# Altium schematic sheet Power Supply.SchDoc: Power Supplies
size A4; DocumentNumber: 4; Revision: D; SheetNumber: 4; SheetTotal: 7
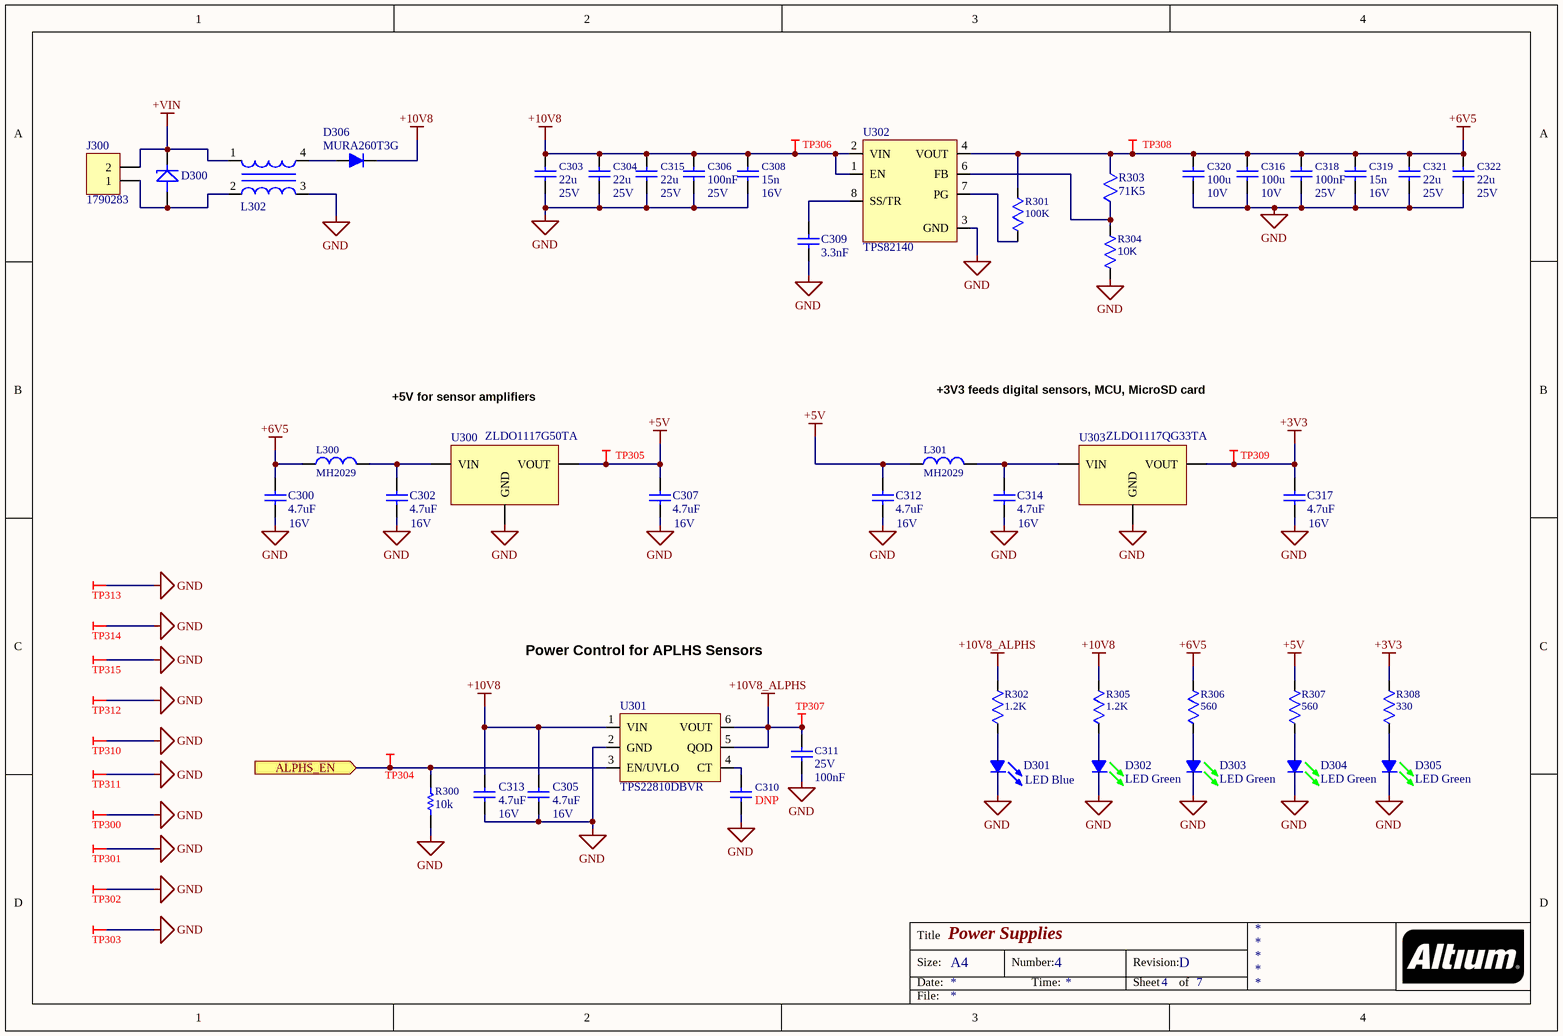
[diagram p0: Power Supply.SchDoc]

## Parts
C300  4.7uF  Voltage: 16V  [C1005[0402]]
C302  4.7uF  Voltage: 16V  [C1005[0402]]
C303  value 22u  Voltage: 25V  [CAPC2012X14N]
C304  value 22u  Voltage: 25V  [CAPC2012X14N]
C305  4.7uF  Voltage: 16V  [C1005[0402]]
C306  value 100nF  Voltage: 25V  [CAPC1005X06N]  (hidden comment: 4.7uF)
C307  4.7uF  Voltage: 16V  [C1005[0402]]
C308  value 15n  Voltage: 16V  [CAPC1005X06N]  (hidden comment: 4.7uF)
C309  3.3nF  [C1608[0603]]
C310  value DNP  [CAPC1005X06N]  (hidden comment: 4.7uF)
C311  value 100nF  Voltage: 25V  [CAPC1005X06N]  (hidden comment: 4.7uF)
C312  4.7uF  Voltage: 16V  [C1005[0402]]
C313  4.7uF  Voltage: 16V  [C1005[0402]]
C314  4.7uF  Voltage: 16V  [C1005[0402]]
C315  value 22u  Voltage: 25V  [CAPC2012X14N]
C316  value 100u  Voltage: 10V  [C3225[1210]_Tall]  (hidden comment: 4.7uF)
C317  4.7uF  Voltage: 16V  [C1005[0402]]
C318  value 100nF  Voltage: 25V  [CAPC1005X06N]  (hidden comment: 4.7uF)
C319  value 15n  Voltage: 16V  [CAPC1005X06N]  (hidden comment: 4.7uF)
C320  value 100u  Voltage: 10V  [C3225[1210]_Tall]  (hidden comment: 4.7uF)
C321  value 22u  Voltage: 25V  [CAPC2012X14N]
C322  value 22u  Voltage: 25V  [CAPC2012X14N]
D300  12V TVS  [NXP PTVSxS1UR-Series (SOD123W)]  (value not drawn)
D301  SMLE12BC7TT86  [LED_0603]  (value not drawn)
D302  LED Green  [LED_0603]
D303  LED Green  [LED_0603]
D304  LED Green  [LED_0603]
D305  LED Green  [LED_0603]
D306  MURA260T3G  [Diode SMA DIOM5226X240N]
J300  1790283  [5.08mm 2pos TermBlock]
L300  MH2029  [L2012[0805]]
L301  MH2029  [L2012[0805]]
L302  CM3421Y600R-10  [CM3421Y600R-10]  (value not drawn)
R300  value 10k  [RESC1005X03N]  (hidden comment: RES: GENERAL)
R301  100K  [RESC1005X03N]
R302  1.2K  [R1608[0603] small]
R303  71K5  [RESC1005X03N]
R304  10K  [RESC1005X03N]
R305  1.2K  [R1608[0603] small]
R306  560  [R1608[0603] small]
R307  560  [R1608[0603] small]
R308  330  [R1608[0603] small]
TP300  PAD  [TP_SMD_39MIL]  (value not drawn)  (no BOM)
TP301  PAD  [TP_SMD_39MIL]  (value not drawn)  (no BOM)
TP302  PAD  [TP_SMD_39MIL]  (value not drawn)  (no BOM)
TP303  PAD  [TP_SMD_39MIL]  (value not drawn)  (no BOM)
TP304  PAD  [TP_SMD_39MIL]  (value not drawn)  (no BOM)
TP305  PAD  [TP_SMD_39MIL]  (value not drawn)  (no BOM)
TP306  PAD  [TP_SMD_39MIL]  (value not drawn)  (no BOM)
TP307  PAD  [TP_SMD_39MIL]  (value not drawn)  (no BOM)
TP308  PAD  [TP_SMD_39MIL]  (value not drawn)  (no BOM)
TP309  PAD  [TP_SMD_39MIL]  (value not drawn)  (no BOM)
TP310  PAD  [TP_SMD_39MIL]  (value not drawn)  (no BOM)
TP311  PAD  [TP_SMD_39MIL]  (value not drawn)  (no BOM)
TP312  PAD  [TP_SMD_39MIL]  (value not drawn)  (no BOM)
TP313  PAD  [TP_SMD_39MIL]  (value not drawn)  (no BOM)
TP314  PAD  [TP_SMD_39MIL]  (value not drawn)  (no BOM)
TP315  PAD  [TP_SMD_39MIL]  (value not drawn)  (no BOM)
U300  ZLDO1117G50TA  [SOT230P700X165-4N]
U301  TPS22810DBVR  [SOT23]
U302  TPS82140  [SIL0008D]
U303  ZLDO1117QG33TA  [SOT230P700X165-4N]

## Ports
ALPHS_EN (in)

## Nets
+3V3: C317.2 R308.2 TP309.1 U303.2(VOUT)
+5V: C307.2 C312.2 L301.1 R307.2 TP305.1 U300.2(VOUT)
+6V5: C300.2 C316.1 C318.1 C319.1 C320.1 C321.1 C322.1 L300.1 R301.2 R303.2 R306.2 TP308.1 U302.4(VOUT)
+10V8: C303.1 C304.1 C305.2 C306.1 C308.1 C313.2 C315.1 D306.1(K) R305.2 TP306.1 U301.1(VIN) U302.1(EN) U302.2(VIN)
+10V8_ALPHS: C311.1 R302.2 TP307.1 U301.5(QOD) U301.6(VOUT)
+VIN: D300.1 J300.2 L302.1
GND: C300.1 C302.1 C303.2 C304.2 C305.1 C306.2 C307.1 C308.2 C309.1 C310.2 C311.2 C312.1 C313.1 C314.1 C315.2 C316.2 C317.1 C318.2 C319.2 C320.2 C321.2 C322.2 D301.2 D302.2 D303.2 D304.2 D305.2 L302.3 R300.2 R304.1 TP300.1 TP301.1 TP302.1 TP303.1 TP310.1 TP311.1 TP312.1 TP313.1 TP314.1 TP315.1 U300.1(GND) U301.2(GND) U302.3(GND) U303.1(GND)
ALPHS_EN: R300.1 TP304.1 U301.3(EN/UVLO) ; port ALPHS_EN
NetC302_2: C302.2 L300.2 U300.3(VIN)
NetC309_2: C309.2 U302.8(SS/TR)
NetC310_1: C310.1 U301.4(CT)
NetC314_2: C314.2 L301.2 U303.3(VIN)
NetD300_2: D300.2 J300.1 L302.2
NetD301_1: D301.1 R302.1
NetD302_1: D302.1 R305.1
NetD303_1: D303.1 R306.1
NetD304_1: D304.1 R307.1
NetD305_1: D305.1 R308.1
NetD306_2: D306.2(A) L302.4
NetR301_1: R301.1 U302.7(PG)
NetR303_1: R303.1 R304.2 U302.6(FB)

## Notes on the sheet
- +3V3 feeds digital sensors, MCU, MicroSD card
- +5V for sensor amplifiers
- Power Control for APLHS Sensors
- LED Blue
- Title
- Size:
- Date:
- A4
- Number:
- Time:
- Revision:
- Sheet
- of
- File:

## Library data of the parts
C300 C302 C305 C307 C312-C314 C317 = 4.7uF_0402_16V: Cap,4.7uF,16V,20%,X5R,0402; Manufacturer Part Number: CL05A475MO5NUNC; Manufacturer: Samsung Electro-Mechanics; Value: 4u7; Supplier 1: Digi-Key; Supplier Part Number 1: 1276-6836-1-ND
  C305 C313: Parameter 1: *
C303 C304 C315 C321 C322 = 4.7uF_0603_10V: Manufacturer Part Number: GRM21BR61E226ME44K; Manufacturer: Murata; ComponentLink1URL: http://www.murata.com/~/media/webrenewal/support/library/catalog/products/capacitor/mlcc/c02e.pdf; ComponentLink1Description: http://www.murata.com/~/media/webrenewal/support/library/catalog/products/capacitor/mlcc/c02e.pdf; Supplier 1: Digi-Key; Supplier Part Number 1: 490-14661-1-ND
C306 C311 C318 = 4.7uF_0603_10V: Manufacturer Part Number: CL05A104KA5NNNC; Manufacturer: Samsung; ComponentLink1URL: http://www.murata.com/~/media/webrenewal/support/library/catalog/products/capacitor/mlcc/c02e.pdf; ComponentLink1Description: http://www.murata.com/~/media/webrenewal/support/library/catalog/products/capacitor/mlcc/c02e.pdf; Supplier 1: Digi-Key; Supplier Part Number 1: 1276-1043-1-ND
C308 C319 = 4.7uF_0603_10V: Manufacturer Part Number: CL05B153KO5NNNC; Manufacturer: Samsung; ComponentLink1URL: http://www.murata.com/~/media/webrenewal/support/library/catalog/products/capacitor/mlcc/c02e.pdf; ComponentLink1Description: http://www.murata.com/~/media/webrenewal/support/library/catalog/products/capacitor/mlcc/c02e.pdf; Supplier 1: Digi-Key; Supplier Part Number 1: 1276-1524-1-ND
C309 = 3.3nF_0603_50V: Cap,3.3nF,50V,10%,X7R,0603; Manufacturer: Samsung; Manufacturer Part Number: CL10B332KB8NNNC; Value: 3n3; Supplier 1: Digi-Key; Supplier Part Number 1: 1276-1758-1-ND; Voltage: 50V
C310 = 4.7uF_0603_10V: Voltage: N/A; ComponentLink1URL: http://www.murata.com/~/media/webrenewal/support/library/catalog/products/capacitor/mlcc/c02e.pdf; ComponentLink1Description: http://www.murata.com/~/media/webrenewal/support/library/catalog/products/capacitor/mlcc/c02e.pdf; Manufacturer Part Number: N/A; Manufacturer: N/A; Supplier 1: N/A; Supplier Part Number 1: N/A
C316 C320 = 4.7uF_0603_10V: Manufacturer Part Number: GRM32ER61A107ME20L; Manufacturer: Murata; ComponentLink1URL: http://www.murata.com/~/media/webrenewal/support/library/catalog/products/capacitor/mlcc/c02e.pdf; ComponentLink1Description: http://www.murata.com/~/media/webrenewal/support/library/catalog/products/capacitor/mlcc/c02e.pdf; Supplier 1: Digi-Key; Supplier Part Number 1: 490-9969-1-ND
D300 = NXP PTVSxS1UR-Series: Manufacturer: Nexperia; Manufacturer Part Number: PTVS12VS1UR,115; Supplier 1: Digi-Key; Supplier Part Number 1: 1727-5325-1-ND
D301 = SMLE12BC7TT86: LED Blue Diffused 0603; Manufacturer: Rohm; Forward (Drive) Current: 5 mA; Forward Voltage: 2.2 V; Supplier 1: Digi-Key; Manufacturer Part Number: SMLE12BC7TT86; Color: Blue; Dimension: 0603; ComponentLink1URL: https://datasheet.ciiva.com/11774/0900766b80df3ada-11774260.pdf; ComponentLink1Description: https://datasheet.ciiva.com/11774/0900766b80df3ada-11774260.pdf; ComponentLink2URL: https://datasheet.ciiva.com/3161/sml-d1-3161419.pdf; ComponentLink2Description: https://datasheet.ciiva.com/3161/sml-d1-3161419.pdf; ComponentLink3URL: https://datasheet.ciiva.com/2110/sml-d1-2110396.pdf; ComponentLink3Description: https://datasheet.ciiva.com/2110/sml-d1-2110396.pdf; ComponentLink4URL: https://datasheet.ciiva.com/2110/sml-d1-2110397.pdf; ComponentLink4Description: https://datasheet.ciiva.com/2110/sml-d1-2110397.pdf; ComponentLink5URL: https://datasheet.ciiva.com/2110/sml-d1-2110398.pdf; ComponentLink5Description: https://datasheet.ciiva.com/2110/sml-d1-2110398.pdf; Supplier Part Number 1: 511-1589-1-ND
D302-D305 = Green LED: LED Green Diffused 0603; Manufacturer: Rohm; Manufacturer Part Number: SML-D12M8WT86; TZOA PN: XXX; Intensity: 100 mcd; Forward (Drive) Current: 20 mA; Forward Voltage: 2.2 V; Supplier 1: Digi-Key; Stock 1: 105158; Pricing 1: 1=0.34, 10=0.251, 25=0.1848, 100=0.132, 250=0.0898, 500=0.0792, 1000=0.062 (USD); Color: Green; Dimension: 0603; Lens Type: Diffused; ComponentLink1URL: https://datasheet.ciiva.com/11774/0900766b80df3ada-11774260.pdf; ComponentLink1Description: https://datasheet.ciiva.com/11774/0900766b80df3ada-11774260.pdf; ComponentLink2URL: https://datasheet.ciiva.com/3161/sml-d1-3161419.pdf; ComponentLink2Description: https://datasheet.ciiva.com/3161/sml-d1-3161419.pdf; ComponentLink3URL: https://datasheet.ciiva.com/2110/sml-d1-2110396.pdf; ComponentLink3Description: https://datasheet.ciiva.com/2110/sml-d1-2110396.pdf; ComponentLink4URL: https://datasheet.ciiva.com/2110/sml-d1-2110397.pdf; ComponentLink4Description: https://datasheet.ciiva.com/2110/sml-d1-2110397.pdf; ComponentLink5URL: https://datasheet.ciiva.com/2110/sml-d1-2110398.pdf; ComponentLink5Description: https://datasheet.ciiva.com/2110/sml-d1-2110398.pdf; Supplier Part Number 1: 511-1578-1-ND; Digikey PN: 511-1578-1-ND
D306 = MURA260T3G: Diode Standard 600V 2A Surface Mount SMA; Manufacturer: ON Semi; Properties: 2A/600V; Supplier Part Number 1: MURA260T3GOSCT-ND; Supplier 1: Digi-Key; Package: SMA; Manufacturer Part Number: MURA260T3G
J300 = TERM BLOCK 2POS 45DEG 5.08MM: 5.08mm Spring Cage, Tension Clamp, Pheonix Contact, 2pos, THD; Manufacturer: Phoenix Contact; Supplier Part Number 1: 277-6722-ND; Manufacturer Part Number: 1790283; Supplier 1: Digi-Key
L300 L301 = Ferrite_MH2029_0805: Ferrite,SMD,3A,30Ohm,0805; Manufacturer: Bourns Inc.; Manufacturer Part Number: MH2029-300Y; Filter Type: Power, Signal Line; Number of Lines: 1; Impedance @ Frequency: 30 Ohm @ 100MHz; DC Resistance (DCR) (Max): 25 mOhm; ID: 1851582; Supplier 1: Digi-Key; Supplier Part Number 1: MH2029-300YCT-ND; RoHS: RoHS Compliant; Category: Filters; Stock: 27744; Pricing: 1=0.14, 10=0.087, 25=0.08, 50=0.072, 100=0.0529, 250=0.03844, 500=0.03524, 1000=0.03043 (CAD); Packaging: Cut Tape (CT); Current Rating (Max): 3A; Ratings: -; Operating Temperature: -55°C ~ 125°C; Package / Case: 0805 (2012 Metric); Mounting Type: Surface Mount; Height (Max): 0.043" (1.10mm); Size / Dimension: 0.079" L x 0.047" W (2.00mm x 1.20mm); ComponentLink1URL: http://www.bourns.com/docs/Product-Datasheets/mh.pdf; ComponentLink1Description: http://www.bourns.com/docs/Product-Datasheets/mh.pdf; Supplier 2: Arrow; Supplier Part Number 2: m2dWQtYZmUCQVruAmfTV4mDHm8tZpH9KPPdphe4ib-E; Package Quantity: 1; ComponentLink2URL: https://www.arrow.com/en/products/mh2029-300y/bourns/; ComponentLink2Description: https://www.arrow.com/en/products/mh2029-300y/bourns/
L302 = CM3421Y600R-10: 2 Line Common Mode Choke Surface Mount 60 Ohms @ 100MHz 15A DCR 0.75mOhm; Manufacturer: Laird; Manufacturer Part Number: CM3421Y600R-10; Value: *; Supplier 1: Digi-Key; Supplier Part Number 1: 240-2501-1-ND
R300 = RES: GENERAL: Manufacturer: Panasonic; Manufacturer Part Number: ERJ-2RKF1002X; Accuracy: *; Distributor Part Number: *; Power: *; Type: *; Distributor: Digi-Key; Package: *; Supplier 1: Digi-Key; Supplier Part Number 1: P10.0KLCT-ND
R301 = 100K_0603_0.1W: Res,SMD,0603,1/10W,100K,1%; Manufacturer: Panasonic; Manufacturer Part Number: ERJ-2RKF1003X; Supplier 1: Digi-Key; ComponentLink1URL: http://industrial.panasonic.com/www-cgi/jvcr13pz.cgi?E+PZ+3+AOA0002+ERJ3EKF1003V+7+WW; ComponentLink1Description: http://industrial.panasonic.com/www-cgi/jvcr13pz.cgi?E+PZ+3+AOA0002+ERJ3EKF1003V+7+WW; ComponentLink2URL: https://www.arrow.com/en/products/erj3ekf1003v/panasonic/; ComponentLink2Description: https://www.arrow.com/en/products/erj3ekf1003v/panasonic/; Supplier Part Number 1: P100KLCT-ND; Value: 100k
R302 R305 = 1K00_0603_0.1W: RES 1K Ohm ±5%, 0.25W,1/4W 0603; Manufacturer: Yageo; Manufacturer Part Number: RC0603FR-071K2L; Supplier 1: Digi-Key; Resistance (Ohms): 1k; ComponentLink1URL: https://datasheet.ciiva.com/2469/esr-2469603.pdf; ComponentLink1Description: https://datasheet.ciiva.com/2469/esr-2469603.pdf; ComponentLink2URL: https://datasheet.ciiva.com/2469/esr-2469604.pdf; ComponentLink2Description: https://datasheet.ciiva.com/2469/esr-2469604.pdf; ComponentLink3URL: https://datasheet.ciiva.com/2469/esr-2469605.pdf; ComponentLink3Description: https://datasheet.ciiva.com/2469/esr-2469605.pdf; Supplier Part Number 1: 311-1.20KHRCT-ND
R303 = 71K5_0603_1/10W: RES SMD 71.5K OHM 1% 1/10W 0603; Manufacturer Part Number: ERJ-2RKF7152X; Manufacturer: Panasonic Electronic Components; Supplier 1: Digi-Key; Supplier Part Number 1: P71.5KLCT-ND
R304 = 1K00_0603_0.1W: RES 1K Ohm ±5%, 0.25W,1/4W 0603; Manufacturer: Panasonic; Manufacturer Part Number: ERJ-2RKF1002X; ComponentLink1URL: https://datasheet.ciiva.com/2469/esr-2469603.pdf; ComponentLink1Description: https://datasheet.ciiva.com/2469/esr-2469603.pdf; ComponentLink2URL: https://datasheet.ciiva.com/2469/esr-2469604.pdf; ComponentLink2Description: https://datasheet.ciiva.com/2469/esr-2469604.pdf; ComponentLink3URL: https://datasheet.ciiva.com/2469/esr-2469605.pdf; ComponentLink3Description: https://datasheet.ciiva.com/2469/esr-2469605.pdf; Value: 10k; Supplier 1: Digi-Key; Supplier Part Number 1: P10.0KLCT-ND
R306 R307 = 1K00_0603_0.1W: RES 1K Ohm ±5%, 0.25W,1/4W 0603; Manufacturer: Rohm; Manufacturer Part Number: RC0603FR-07560RL; Supplier 1: Digi-Key; Resistance (Ohms): 1k; ComponentLink1URL: https://datasheet.ciiva.com/2469/esr-2469603.pdf; ComponentLink1Description: https://datasheet.ciiva.com/2469/esr-2469603.pdf; ComponentLink2URL: https://datasheet.ciiva.com/2469/esr-2469604.pdf; ComponentLink2Description: https://datasheet.ciiva.com/2469/esr-2469604.pdf; ComponentLink3URL: https://datasheet.ciiva.com/2469/esr-2469605.pdf; ComponentLink3Description: https://datasheet.ciiva.com/2469/esr-2469605.pdf; Supplier Part Number 1: 311-560HRCT-ND
R308 = 1K00_0603_0.1W: RES 1K Ohm ±5%, 0.25W,1/4W 0603; Manufacturer: Rohm; Manufacturer Part Number: RC0603FR-07330RL; Value: 330R; Supplier 1: Digi-Key; Resistance (Ohms): 1k; ComponentLink1URL: https://datasheet.ciiva.com/2469/esr-2469603.pdf; ComponentLink1Description: https://datasheet.ciiva.com/2469/esr-2469603.pdf; ComponentLink2URL: https://datasheet.ciiva.com/2469/esr-2469604.pdf; ComponentLink2Description: https://datasheet.ciiva.com/2469/esr-2469604.pdf; ComponentLink3URL: https://datasheet.ciiva.com/2469/esr-2469605.pdf; ComponentLink3Description: https://datasheet.ciiva.com/2469/esr-2469605.pdf; Supplier Part Number 1: 311-330HRCT-ND
TP300-TP315 = TP_SMD_39MIL: SMD Test Pad; Manufacturer: No P/N Required; P/N: No P/N; UM: EA; Fast Supplier: No P/N Required; Fast Supplier P/N: No P/N Required; Manufacturer P/N: No P/N Required
U300 U303 = ZLDO1117: 1A 3.3V LDO; Manufacturer: Diodes Incorporated; Supplier 1: Digi-Key
  U300: Manufacturer Part Number: ZLDO1117G50TA; Supplier Part Number 1: ZLDO1117G50DICT-ND
  U303: Manufacturer Part Number: ZLDO1117QG33TA; Supplier Part Number 1: ZLDO1117QG33TADICT-ND
U301 = TPS22810DBVR: High Side Load Switch; Manufacturer: Texas Instruments; Supplier 1: Digi-Key; Manufacturer Part Number: TPS22810DBVR; Supplier Part Number 1: 296-45297-1-ND
U302 = TPS82140: DC-DC: 0.9-6V 2A output, 3-17V input. Non-isolated.; Manufacturer: Texas Instruments; Manufacturer Part Number: TPS82140SILT; Supplier 1: Digi-Key; Supplier Part Number 1: 296-47089-1-ND; ComponentLink1Description: wefwef; ComponentLink1URL: https://www.digikey.ca/product-detail/en/texas-instruments/TPS82140SILT/296-47089-1-ND/7596470